# EAGLE design USB_SMBus (EAGLE 9.5.0)
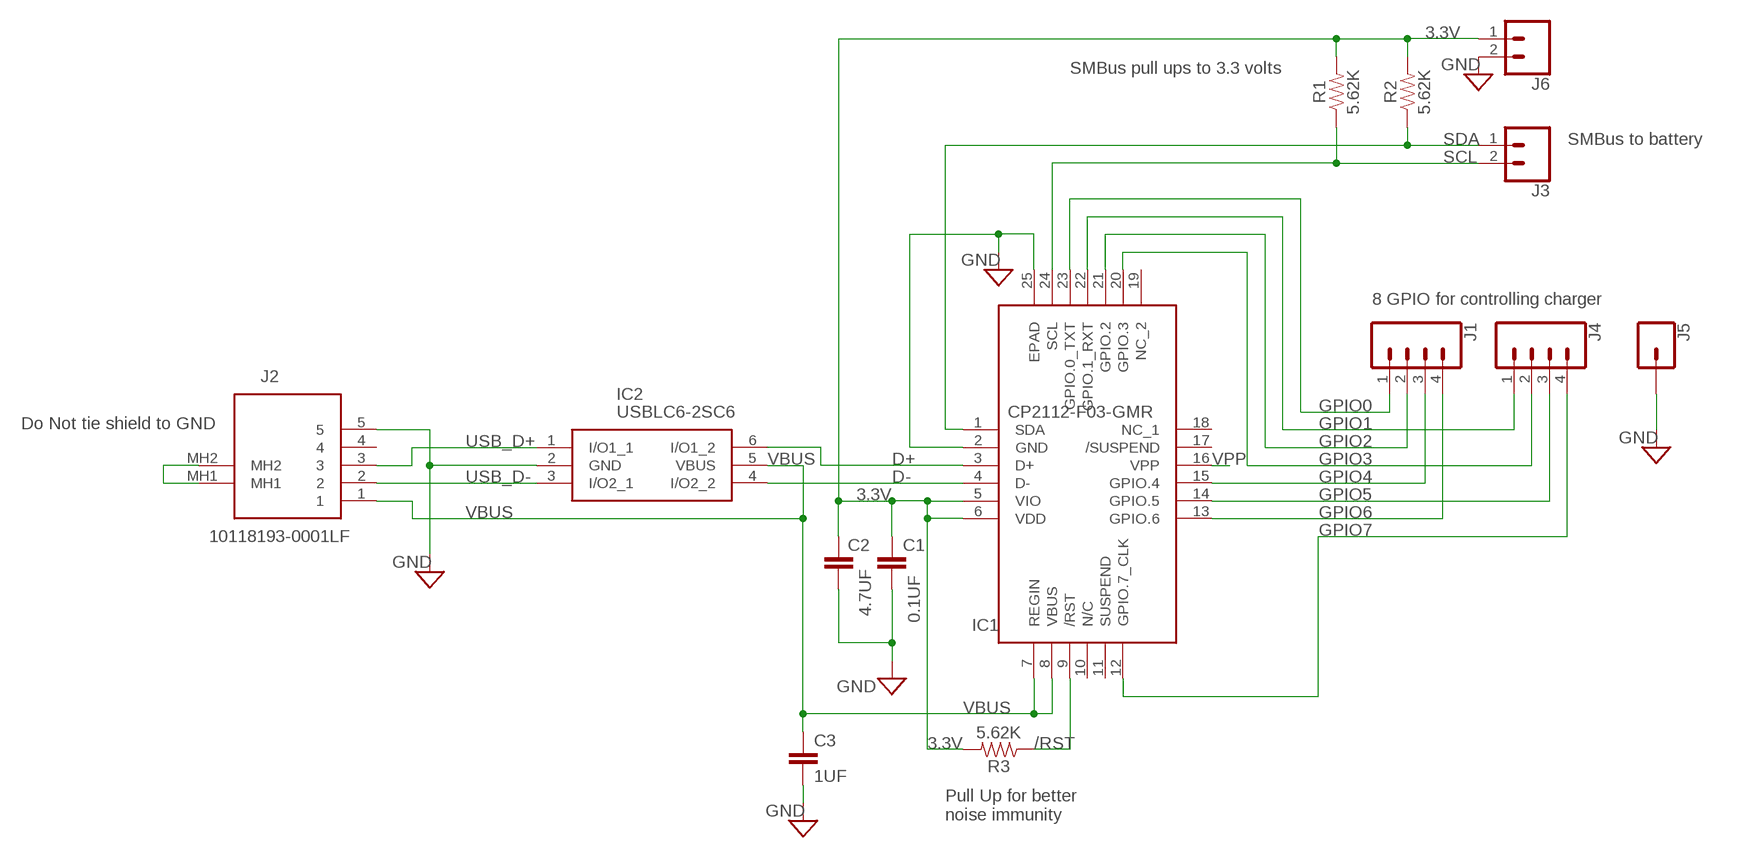
[diagram p0: schematic, sheet 1]

## Parts
C1  0.1UF  0805_CAP  [0805_CAP]
C2  4.7UF  0805_CAP  [0805_CAP]
C3  1UF  0805_CAP  [0805_CAP]
IC1  CP2112-F03-GMR  [QFN50P400X400X80-25N]
IC2  USBLC6-2SC6  [SOT95P280X145-6N]
J1  CONN_04  [1X04]
J2  10118193-0001LF  [101181930001LF]
J3  CONN_02  [1X02]
J4  CONN_04  [1X04]
J5  CONN_01  [1X01]
J6  CONN_02  [1X02]
R1  5.62K  0603_RESISTOR  [0603_RESISTOR]
R2  5.62K  0603_RESISTOR  [0603_RESISTOR]
R3  5.62K  0603_RESISTOR  [0603_RESISTOR]

## Nets
3.3V: C1.1 C2.1 IC1.5(VIO) IC1.6(VDD) J6.1 R1.2 R2.2 R3.2
/RST: IC1.9(/RST) R3.1
D+: IC1.3(D+) IC2.6(I/O1_2)
D-: IC1.4(D-) IC2.4(I/O2_2)
GND: C1.2 C2.2 C3.2 IC1.2(GND) IC1.25(EPAD) IC2.2(GND) J2.5 J5.1 J6.2
GPIO0: IC1.23(GPIO.0_TXT) J1.1
GPIO1: IC1.22(GPIO.1_RXT) J4.1
GPIO2: IC1.21(GPIO.2) J1.2
GPIO3: IC1.20(GPIO.3) J4.2
GPIO4: IC1.15(GPIO.4) J1.3
GPIO5: IC1.14(GPIO.5) J4.3
GPIO6: IC1.13(GPIO.6) J1.4
GPIO7: IC1.12(GPIO.7_CLK) J4.4
N$1: J2.MH1 J2.MH2
SCL: IC1.24(SCL) J3.2 R1.1
SDA: IC1.1(SDA) J3.1 R2.1
USB_D+: IC2.1(I/O1_1) J2.3
USB_D-: IC2.3(I/O2_1) J2.2
VBUS: C3.1 IC1.7(REGIN) IC1.8(VBUS) IC2.5(VBUS) J2.1
VPP: IC1.16(VPP)
Unconnected: IC1.10(N/C) IC1.11(SUSPEND) IC1.17(/SUSPEND) IC1.18(NC_1) IC1.19(NC_2) J2.4

## Notes on the sheet
- SMBus pull ups to 3.3 volts
- SMBus to battery
- 8 GPIO for controlling charger
- Do Not tie shield to GND
- Pull Up for better
  noise immunity

## Library data of the parts
C1-C3 = 0805_CAP:0805_CAP
IC1 = SamacSys_Parts:CP2112-F03-GMR: USB Interface IC HID USB to SMBUS Bridge QFN24 Source: Datasheet; DESCRIPTION: USB Interface IC HID USB to SMBUS Bridge QFN24; HEIGHT: 0.8mm; MANUFACTURER_NAME: Silicon Labs; MANUFACTURER_PART_NUMBER: CP2112-F03-GMR; MOUSER_PART_NUMBER: 634-CP2112-F03-GMR; MOUSER_PRICE-STOCK: https://www.mouser.co.uk/ProductDetail/Silicon-Labs/CP2112-F03-GMR/?qs=5aG0NVq1C4xTtcRh7H2oKQ%3D%3D
IC2 = SamacSys_Parts:USBLC6-2SC6: TVS Diode Array Uni-Directional USBLC6-2SC6 17V, SOT-23 6-Pin Source: Datasheet <http://www.st.com/st-web-ui/static/active/en/resource/technical/document/datasheet/CD00050750.pdf>; DESCRIPTION: TVS Diode Array Uni-Directional USBLC6-2SC6 17V, SOT-23 6-Pin; HEIGHT: 1.45mm; MANUFACTURER_NAME: STMicroelectronics; MANUFACTURER_PART_NUMBER: USBLC6-2SC6; MOUSER_PART_NUMBER: 511-USBLC6-2SC6; MOUSER_PRICE-STOCK: https://www.mouser.co.uk/ProductDetail/STMicroelectronics/USBLC6-2SC6?qs=po45yt2pPpu%2FhNIlwQdTlg%3D%3D
J1 J4 = SparkFun-Connectors:CONN_04: Multi connection point. Often used as Generic Header-pin footprint for 0.1 inch spaced/style header connections On any of the 0.1 inch spaced packages, you can populate with these: Break Away Headers - Straight <https://www.sparkfun.com/products/116> (PRT-00116) Break Away Male Headers - Right Angle <https://www.sparkfun.com/products/553> (PRT-00553) Female Headers <https://www.sparkfun.com/products/115> (PRT-00115) Break Away Headers - Machine Pin <https://www.sparkfun.com/products/117> (PRT-00117) Break Away Female Headers - Swiss Machine Pin <https://www.sparkfun.com/products/743> (PRT-00743) For SCREWTERMINALS and SPRING TERMINALS visit here: Screw Terimnals on SparkFun.com <https://www.sparkfun.com/search/results?term=Screw+Terminals> (5mm/3.5mm/2.54mm spacing) This device is also useful as a general connection point to wire up your design to another part of your project. Our various solder wires solder well into these plated through hole pads. Hook-Up Wire - Assortment (Stranded, 22 AWG) <https://www.sparkfun.com/products/11375> (PRT-11375) Hook-Up Wire - Assortment (Solid Core, 22 AWG) <https://www.sparkfun.com/products/11367> (PRT-11367) View the entire wire category on our website here <https://www.sparkfun.com/categories/141> Special notes: Molex polarized connector foot print use with SKU : PRT-08231 with associated crimp pins and housings. 1MM SMD Version SKU: PRT-10208; PROD_ID: CONN-09696
J2 = SamacSys_Parts:10118193-0001LF: USB Connectors 5P MICRO USB TYPE B RECEPTACLE W/ PEGS Source: Datasheet <https://componentsearchengine.com/Datasheets/1/10118193-0001LF.pdf>; DESCRIPTION: USB Connectors 5P MICRO USB TYPE B RECEPTACLE W/ PEGS; HEIGHT: 3.1mm; MANUFACTURER_NAME: Amphenol; MANUFACTURER_PART_NUMBER: 10118193-0001LF; MOUSER_PART_NUMBER: 649-10118193-0001LF; MOUSER_PRICE-STOCK: https://www.mouser.co.uk/ProductDetail/Amphenol-FCI/10118193-0001LF?qs=Ywefl8B65e63Nsqd%252B8HZaQ%3D%3D
J3 J6 = SparkFun-Connectors:CONN_02: Multi connection point. Often used as Generic Header-pin footprint for 0.1 inch spaced/style header connections On any of the 0.1 inch spaced packages, you can populate with these: Break Away Headers - Straight <https://www.sparkfun.com/products/116> (PRT-00116) Break Away Male Headers - Right Angle <https://www.sparkfun.com/products/553> (PRT-00553) Female Headers <https://www.sparkfun.com/products/115> (PRT-00115) Break Away Headers - Machine Pin <https://www.sparkfun.com/products/117> (PRT-00117) Break Away Female Headers - Swiss Machine Pin <https://www.sparkfun.com/products/743> (PRT-00743) For SCREWTERMINALS and SPRING TERMINALS visit here: Screw Terimnals on SparkFun.com <https://www.sparkfun.com/search/results?term=Screw+Terminals> (5mm/3.5mm/2.54mm spacing) This device is also useful as a general connection point to wire up your design to another part of your project. Our various solder wires solder well into these plated through hole pads. Hook-Up Wire - Assortment (Stranded, 22 AWG) <https://www.sparkfun.com/products/11375> (PRT-11375) Hook-Up Wire - Assortment (Solid Core, 22 AWG) <https://www.sparkfun.com/products/11367> (PRT-11367) View the entire wire category on our website here <https://www.sparkfun.com/categories/141> Special notes: Molex polarized connector foot print use with: PRT-08233 with associated crimp pins and housings. 2.54_SCREWTERM for use with PRT-10571. 3.5mm Screw Terminal footprints for PRT-08084 5mm Screw Terminal footprints for use with PRT-08432
J5 = SparkFun-Connectors:CONN_01: Single connection point. Often used as Generic Header-pin footprint for 0.1 inch spaced/style header connections On any of the 0.1 inch spaced packages, you can populate with these: Break Away Headers - Straight <https://www.sparkfun.com/products/116> (PRT-00116) Break Away Male Headers - Right Angle <https://www.sparkfun.com/products/553> (PRT-00553) Female Headers <https://www.sparkfun.com/products/115> (PRT-00115) Break Away Headers - Machine Pin <https://www.sparkfun.com/products/117> (PRT-00117) Break Away Female Headers - Swiss Machine Pin <https://www.sparkfun.com/products/743> (PRT-00743) This device is also useful as a general connection point to wire up your design to another part of your project. Our various solder wires solder well into these plated through hole pads. Hook-Up Wire - Assortment (Stranded, 22 AWG) <https://www.sparkfun.com/products/11375> (PRT-11375) Hook-Up Wire - Assortment (Solid Core, 22 AWG) <https://www.sparkfun.com/products/11367> (PRT-11367) View the entire wire category on our website here <https://www.sparkfun.com/categories/141> Special notes: SMTSO-256-ET is a "flush mount" nut for a 4-40 screw. We mostly use this on specialty testbeds; it is a nice way to connect hardware to your PCB at an adjustable hieght. Also note, the SNAP packages are for using a snappable style connector. We sell a baggie of snaps and they are also used on two LilyPad designs: Snap Assortment - 30 pack (male and female) <https://www.sparkfun.com/products/11347> (DEV-11347) LilyPad Arduino SimpleSnap <https://www.sparkfun.com/products/10941> (DEV-10941) LilyPad SimpleSnap Protoboard <https://www.sparkfun.com/products/10940> (DEV-10940)
R1-R3 = 0603_RESISTOR:0603_RESISTOR

## Board
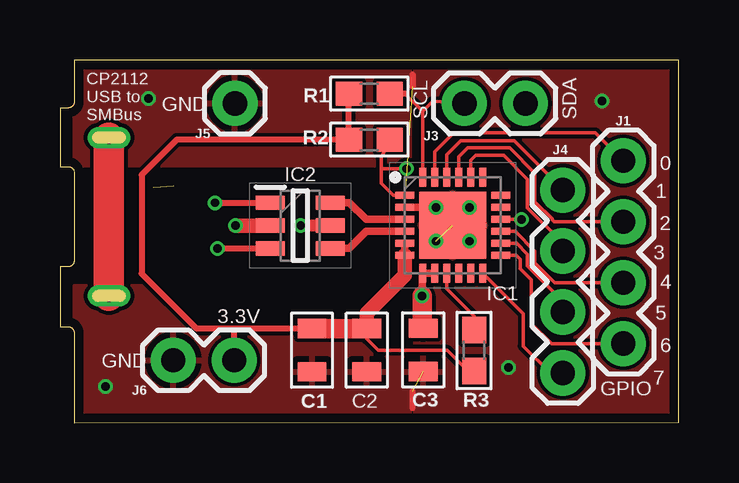
[diagram p1: board, top side]
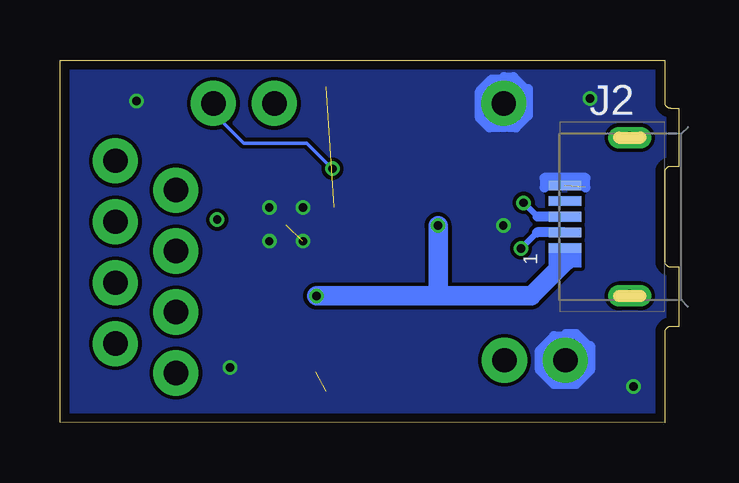
[diagram p2: board, bottom side, seen from below]

Size 25.78 x 15.11 mm. Coordinates in mm from the lower left corner, seen from the top.
Outline: 0.59,0 25.78,0.01 25.78,15.11 0.59,15.1 0.59,13.36 arc-90 0.34,13.11 0,13.11 0,10.67 0.34,10.67 arc-90 0.59,10.42 0.59,6.74 arc-90 0.34,6.49 0,6.49 0,4 0.34,4 arc-90 0.59,3.75 0.59,0
Copper layers (1*16): Top 0.035559375mm / dielectric 1.6mm / Bottom 0.035559375mm
Design rules "oshpark-2layer": minimum track width 6mil, minimum drill 10mil, track to track 6mil, track to pad 6mil, pad to pad 6mil, via to via 6mil, smd to smd 6mil, copper to edge 15mil, drill to drill 6mil, minimum pad ring 5mil, minimum via ring 5mil, stop-mask expansion 2.5mil, vias tented up to drill 0mil, thermal gap 10mil

### Footprints (pad centres in the part's own frame; a part is rotated, then mirrored left to right if it is on the bottom)
0805_CAP = smd 0.8 x 1.2: 1 -0.9,0; 2 0.9,0
QFN50P400X400X80-25N = smd 0.8 x 0.3: 1 -2,1.25; 2 -2,0.75; 3 -2,0.25; 4 -2,-0.25; 5 -2,-0.75; 6 -2,-1.25; 13 2,-1.25; 14 2,-0.75; 15 2,-0.25; 16 2,0.25; 17 2,0.75; 18 2,1.25 | smd 0.3 x 0.8: 7 -1.25,-2; 8 -0.75,-2; 9 -0.25,-2; 10 0.25,-2; 11 0.75,-2; 12 1.25,-2; 19 1.25,2; 20 0.75,2; 21 0.25,2; 22 -0.25,2; 23 -0.75,2; 24 -1.25,2 | smd 2.8 x 2.8: 25 0,0
SOT95P280X145-6N = smd 1.2 x 0.6: 1 -1.25,0.95; 2 -1.25,0; 3 -1.25,-0.95; 4 1.25,-0.95; 5 1.25,0; 6 1.25,0.95
1X04 = drill 1.016 pad 1.88: 1 0,0; 2 2.54,0; 3 5.08,0; 4 7.62,0
101181930001LF = smd 0.4 x 1.35: 1 -1.3,2.6; 2 -0.65,2.6; 3 0,2.6; 4 0.65,2.6; 5 1.3,2.6 | drill 0.5 pad 0.9 long: MH1 -3.3,-0.1; MH2 3.3,-0.1
1X02 = drill 1.016 pad 1.88: 1 0,0; 2 2.54,0
1X01 = drill 1.016 pad 1.88: 1 0,0
0603_RESISTOR = smd 1.1 x 1: 1 -0.85,0; 2 0.85,0

### Placement (x,y rotation side)
C1  10.5,3.02 270 top
C2  12.78,3.02 270 top
C3  15.13,3.03 270 top
IC1  16.36,8.22 0 top
IC2  10.01,8.21 0 top
J1  23.47,10.91 270 top
J2  2.14,8.58 90 bottom
J3  19.39,13.3 180 top
J4  20.95,9.69 270 top
J5  7.29,13.3 0 top
J6  7.26,2.6 180 top
R1  12.89,13.71 180 top
R2  12.89,11.79 180 top
R3  17.25,3.01 270 top

### Tracks (layer width: path | path; a pad name or v marks a point on that pad's centre or on a via)
3.3V
  Top 0.152: R3.2 16.99,2.16 16.14,3.01 13.26,3.01 12.78,3.49 C2.1
  Top 0.254: C1.1 7.26,3.92 | 7.26,3.92 5.69,3.92 3.4,6.21 3.4,10.32 4.87,11.79 R2.2 R1.2 | J6.1 7.26,3.92
  Top 0.305: IC1.5 IC1.6
  Top 0.61: IC1.6 14.36,6.14 12.78,4.56 C2.1
  Top 0.813: C2.1 C1.1
/RST
  Top 0.152: IC1.9 16.11,5.58 17.25,4.44 R3.1
D+
  Top 0.305: IC1.3 12.75,8.47 12.06,9.16 IC2.6
D-
  Top 0.305: IC1.4 12.76,7.97 12.05,7.26 IC2.4
GND  (via drill 0.35)  (4 unrouted)
  Top 0.254: 14.69,14.5 14.69,14 | 14.69,0.6 14.69,1.3
  Top 0.305: IC1.2 15.61,8.97 IC1.25
  Top 0.61: IC2.2 v7.31,8.21
  Bottom 0.406: 3.89,9.8 3.89,10.2 5.59,10.2 5.59,9.8 | 7.29,14.4 6.89,14.4 6.39,13.9 6.29,13.9 6.29,12.8 6.79,12.3 7.89,12.3 8.29,12.7 8.29,13.8 7.79,14.3 7.39,14.3 | 4.69,3.7 4.29,3.7 3.79,3.2 3.69,3.2 3.69,2.2 4.29,1.6 5.19,1.6 5.79,2.2 5.79,3 5.19,3.6 4.79,3.6
  other vias: 15.66,7.56 17.06,7.56 17.06,8.96 15.66,8.96 18.69,2.3 22.59,13.4 3.69,13.5 1.89,1.5
  pour Bottom: 0.59,0 0.59,15.1 25.79,15.1 25.79,0
  pour Top: 0.59,15.1 0.59,10.7 14.59,10.7 14.59,15.1
  pour Top: 0.59,0 0.59,5.7 14.59,5.7 14.59,0
  pour Top: 14.79,15.1 14.79,0 25.79,0 25.79,15.1
GPIO0
  Top 0.152: IC1.23 15.61,11.28 16.4,12.07 22.31,12.07 J1.1
GPIO1
  Top 0.152: IC1.22 16.11,11.17 16.7,11.76 18.92,11.76 20.95,9.72 J4.1
GPIO2
  Top 0.152: IC1.21 16.61,11.08 16.98,11.45 18.73,11.45 19.78,10.4 19.78,9.21 20.5,8.49 20.5,8.46 20.59,8.37 J1.2
GPIO3
  Top 0.152: IC1.20 17.11,10.93 17.33,11.15 18.48,11.15 19.48,10.15 19.48,8.96 20.95,7.49 J4.2
GPIO4
  Top 0.152: IC1.15 18.96,7.97 19.78,7.15 19.78,6.67 20.62,5.83 J1.3
GPIO5
  Top 0.152: IC1.14 19.03,7.47 19.48,7.02 19.48,6.54 20.95,5.07 J4.3
GPIO6
  Top 0.152: IC1.13 19,6.97 19.17,6.8 19.17,6.41 19.64,5.95 19.64,4.13 20.48,3.29 J1.4
GPIO7
  Top 0.152: IC1.12 19.3,4.53 19.3,3.19 20.42,2.07 J4.4
N$1
  Top 1.27: J2.MH2 J2.MH1
SCL
  Top 0.152: IC1.24 15.11,12.97 | 15.11,12.97 14.37,13.71 | 15.11,12.97 15.52,13.38 J3.2
  Top 0.254: 14.37,13.71 R1.1
SDA  (via drill 0.35)
  Top 0.152: IC1.1 13.88,9.47 13.38,9.97 13.38,10.58 | R2.1 13.38,11.03 13.38,10.58 | 13.38,10.58 v14.43,10.58
  Bottom 0.152: v14.43,10.58 15.5,11.65 18.13,11.65 19.38,12.9 J3.1
USB_D+  (via drill 0.35)
  Top 0.254: v6.46,9.16 IC2.1
  Bottom 0.254: 5.88,8.58 v6.46,9.16
  Bottom 0.406: J2.3 5.88,8.58
USB_D-  (via drill 0.35)
  Top 0.254: v6.57,7.26 IC2.3
  Bottom 0.254: 5.9,7.93 v6.57,7.26
  Bottom 0.406: J2.2 5.9,7.93
VBUS  (via drill 0.35)
  Top 0.305: v15.09,5.28 15.09,6.2 IC1.7 IC1.8
  Top 0.508: IC2.5 v10.03,8.21
  Top 0.813: v15.09,5.28 15.09,3.97 C3.1
  Bottom 0.406: J2.1 4.7,6.75
  Bottom 0.813: 4.7,6.75 4.7,6.73 6.14,5.29 6.16,5.29 6.16,5.28 10.03,5.28 | v15.09,5.28 10.03,5.28 | v10.03,8.21 10.03,5.28
VPP  (via drill 0.35)
  Top 0.152: IC1.16 v19.22,8.47 v19.23,8.46
(copper drawn outside any net)
  shapes: Bottom area x1

### Text on the board
tPlace: CP2112 / USB to / SMBus | GND | SCL | SDA | 0 | 1 | 2 | 3 | 4 | 3.3V | 5 | 6 | GND | 7 | GPIO